# EAGLE design ADCMP607-TDR-head (EAGLE 9.5.0)
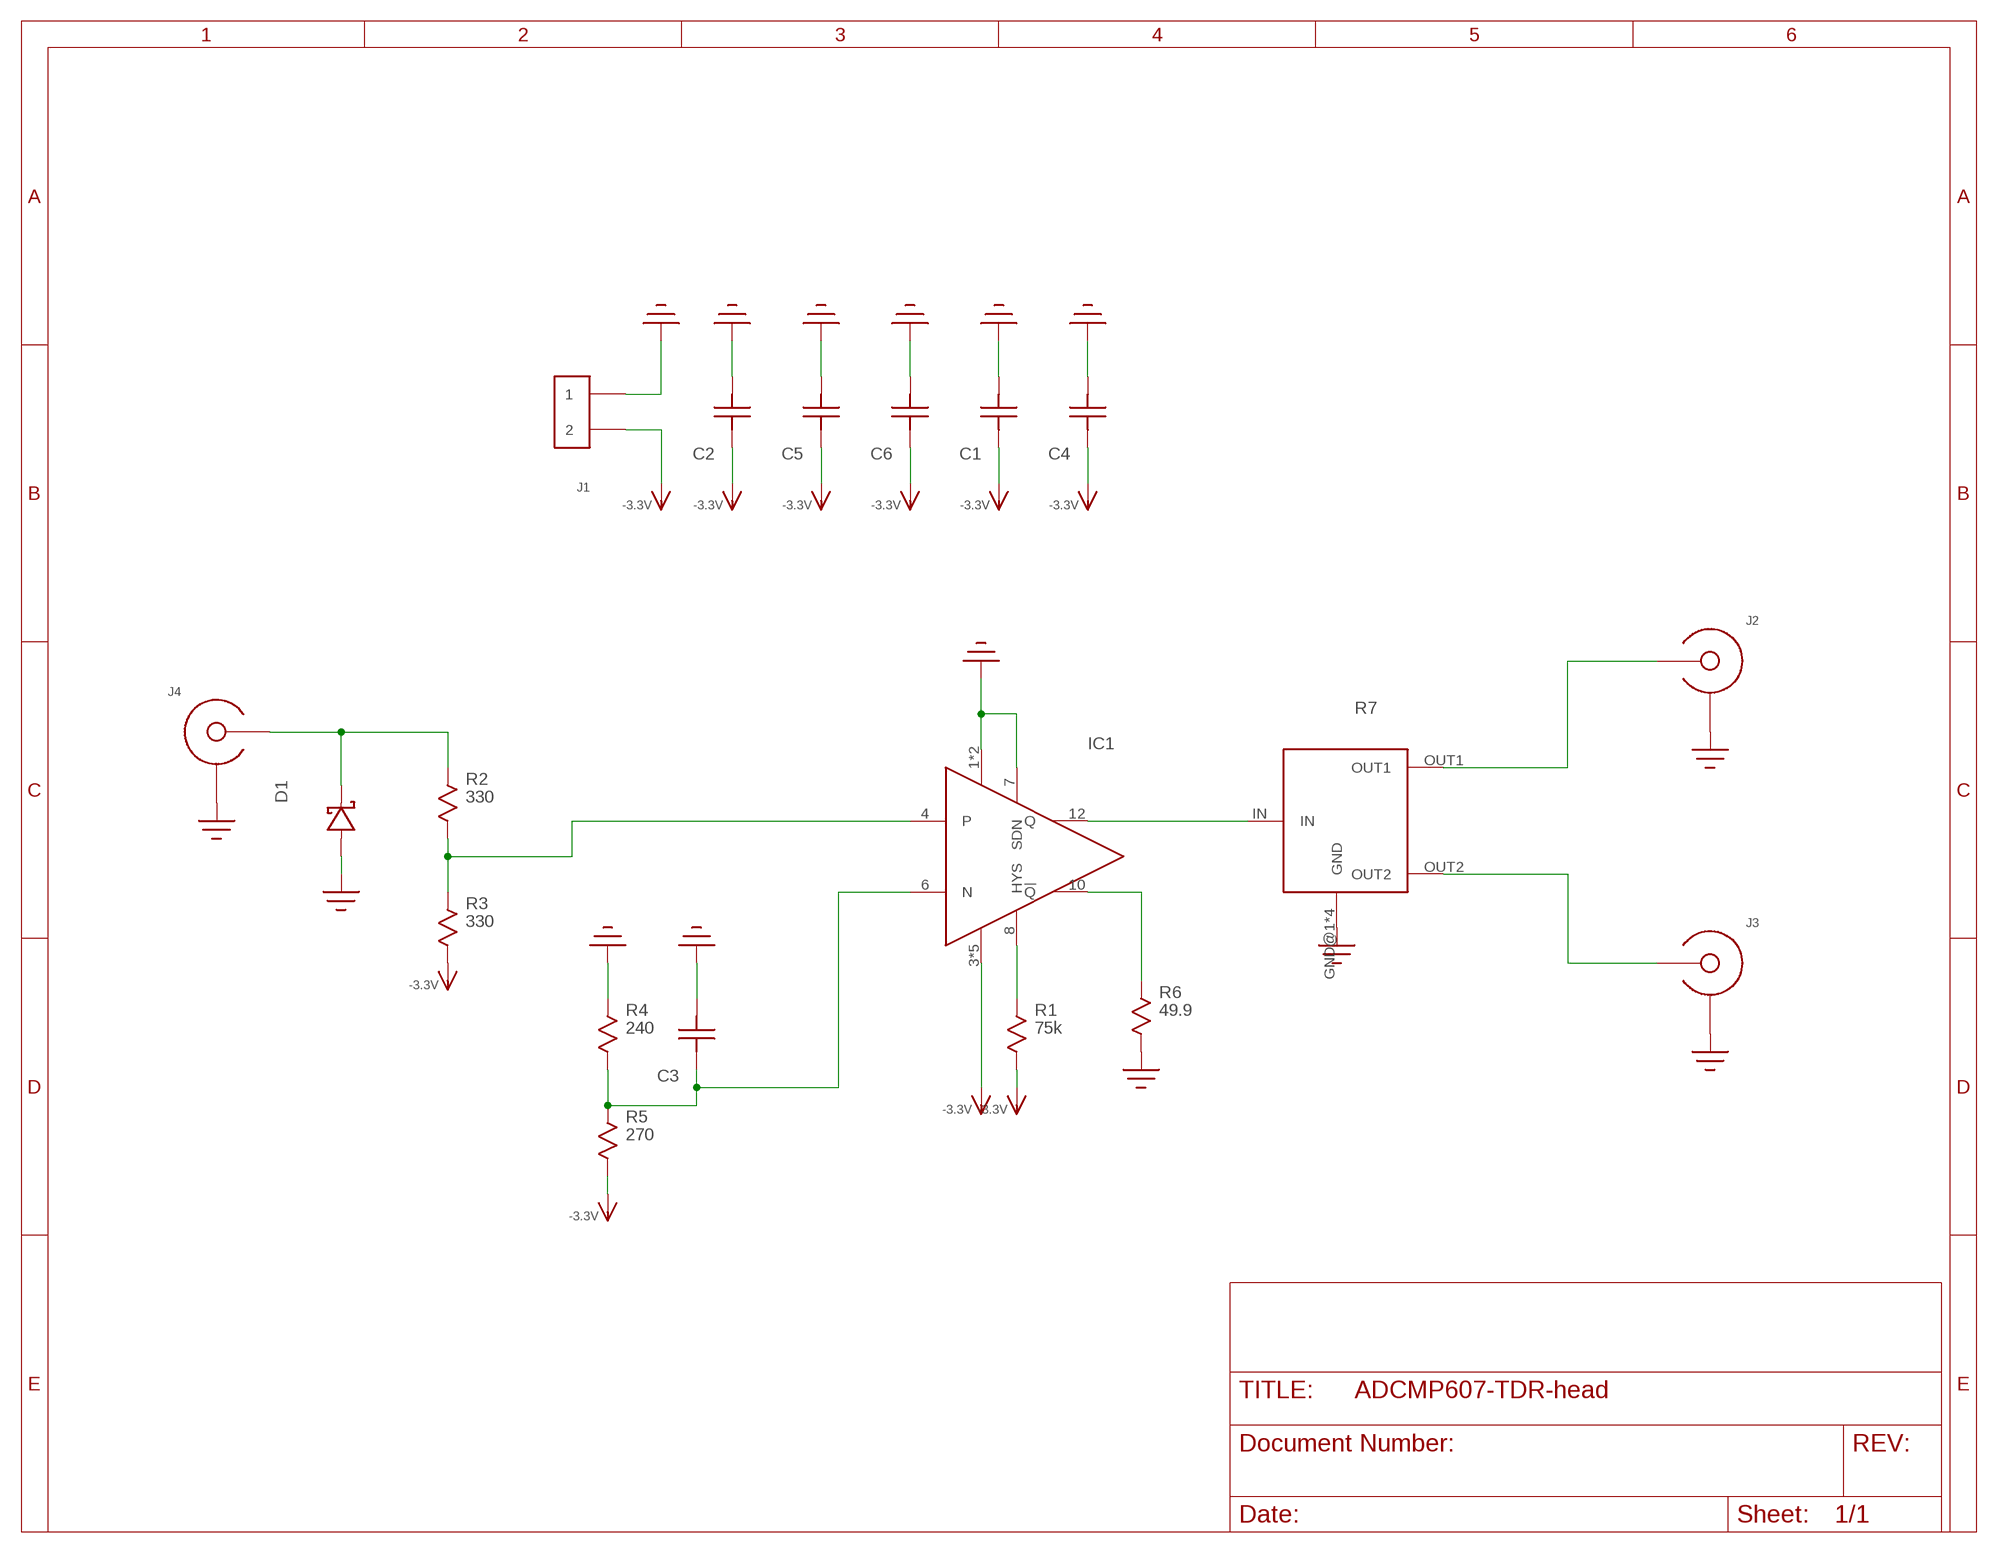
[diagram p0: schematic, sheet 1]

## Parts
C1  C0603  [C0603]
C2  C1206  [1206]
C3  C0603  [C0603]
C4  C0603  [C0603]
C5  C0603  [C0603]
C6  C0603  [C0603]
D1  SCHOTTKYSOT-23  [SOT-23]
IC1  ADCMP607  [QFN12-3X3]
J1  HEADER_2PIN  [HEADER_2PIN]
J2  SMA-EDGE-LAUNCH4020_TAPER  [SMA_EDGE_LAUNCH_2L_4020_TAPER]
J3  SMA-EDGE-LAUNCH4020_TAPER  [SMA_EDGE_LAUNCH_2L_4020_TAPER]
J4  SMA-EDGE-LAUNCH4020_TAPER  [SMA_EDGE_LAUNCH_2L_4020_TAPER]
R1  75k  R0603  [R0603]
R2  330  R0603  [R0603]
R3  330  R0603  [R0603]
R4  240  R0603  [R0603]
R5  270  R0603  [R0603]
R6  49.9  R0402  [0402]
R7  PS2012G-SPLITTER  [PS2012G-SPLITTER]

## Nets
-3.3V: C1.P$2 C2.P$2 C4.P$2 C5.P$2 C6.P$2 IC1.3(VEE) IC1.5(VEE) IC1.9(VEE) IC1.11(VEE) IC1.EP(VEE) J1.2 R1.P$2 R3.P$2 R5.P$2
GND: C1.P$1 C2.P$1 C3.P$1 C4.P$1 C5.P$1 C6.P$1 D1.1(ANODE) IC1.1(VCC) IC1.2(VCC) IC1.7(SDN) J1.1 J2.BOTTOM_GND(SHIELD) J2.GND@1(SHIELD) J2.GND@2(SHIELD) J2.GND@3(SHIELD) J2.GND@4(SHIELD) J2.GND@5(SHIELD) J2.GND@6(SHIELD) J2.GND@7(SHIELD) J2.GND@8(SHIELD) J2.GND@14(SHIELD) J2.GND@15(SHIELD) J2.GND@16(SHIELD) J2.GND@17(SHIELD) J2.GND_PAD1(SHIELD) J2.GND_PAD2(SHIELD) J2.P$1(SHIELD) J2.P$2(SHIELD) J3.BOTTOM_GND(SHIELD) J3.GND@1(SHIELD) J3.GND@2(SHIELD) J3.GND@3(SHIELD) J3.GND@4(SHIELD) J3.GND@5(SHIELD) J3.GND@6(SHIELD) J3.GND@7(SHIELD) J3.GND@8(SHIELD) J3.GND@14(SHIELD) J3.GND@15(SHIELD) J3.GND@16(SHIELD) J3.GND@17(SHIELD) J3.GND_PAD1(SHIELD) J3.GND_PAD2(SHIELD) J3.P$1(SHIELD) J3.P$2(SHIELD) J4.BOTTOM_GND(SHIELD) J4.GND@1(SHIELD) J4.GND@2(SHIELD) J4.GND@3(SHIELD) J4.GND@4(SHIELD) J4.GND@5(SHIELD) J4.GND@6(SHIELD) J4.GND@7(SHIELD) J4.GND@8(SHIELD) J4.GND@14(SHIELD) J4.GND@15(SHIELD) J4.GND@16(SHIELD) J4.GND@17(SHIELD) J4.GND_PAD1(SHIELD) J4.GND_PAD2(SHIELD) J4.P$1(SHIELD) J4.P$2(SHIELD) R4.P$1 R6.2 R7.GND@1(GND) R7.GND@2(GND) R7.GND@3(GND) R7.GND@4(GND)
N$1: C3.P$2 IC1.6(N) R4.P$2 R5.P$1
N$2: IC1.8(HYS) R1.P$1
N$3 [29-6]: IC1.12(Q) R7.IN
N$4 [29-6]: IC1.10(!Q!) R6.1
N$5 [29-6]: D1.3(CATHODE) J4.CENTER@1(CENTER) R2.P$1
N$6 [29-6]: IC1.4(P) R2.P$2 R3.P$1
N$7: J2.CENTER@1(CENTER) R7.OUT1
N$8: J3.CENTER@1(CENTER) R7.OUT2

## Library data of the parts
C1-C6 = yapo:C
D1 = yapo:SCHOTTKY
IC1 = yapo:ADCMP607
J1 = yapo:HEADER_2PIN
J2-J4 = yapo:SMA-EDGE-LAUNCH
R1-R6 = yapo:R
R7 = yapo:PS2012G-SPLITTER

## Net classes
1 29-6: width 0.737 mm, clearance 0.152 mm

## Board
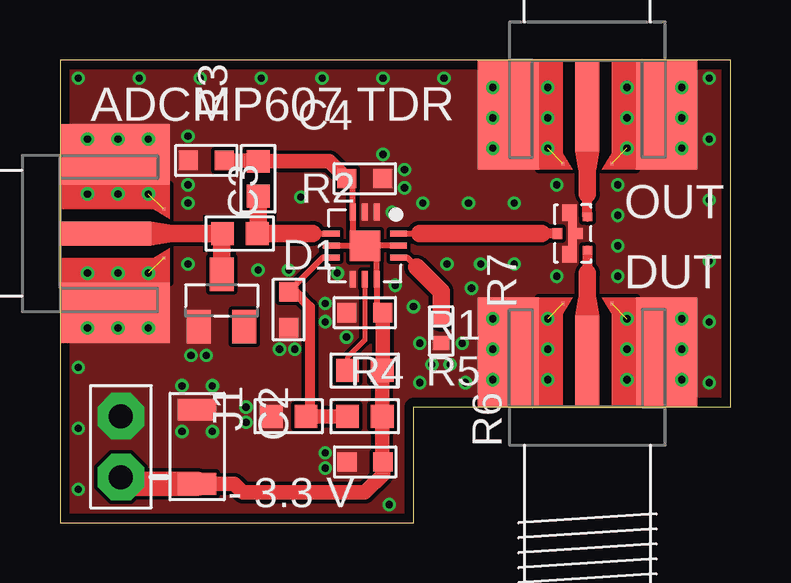
[diagram p1: board, top side]
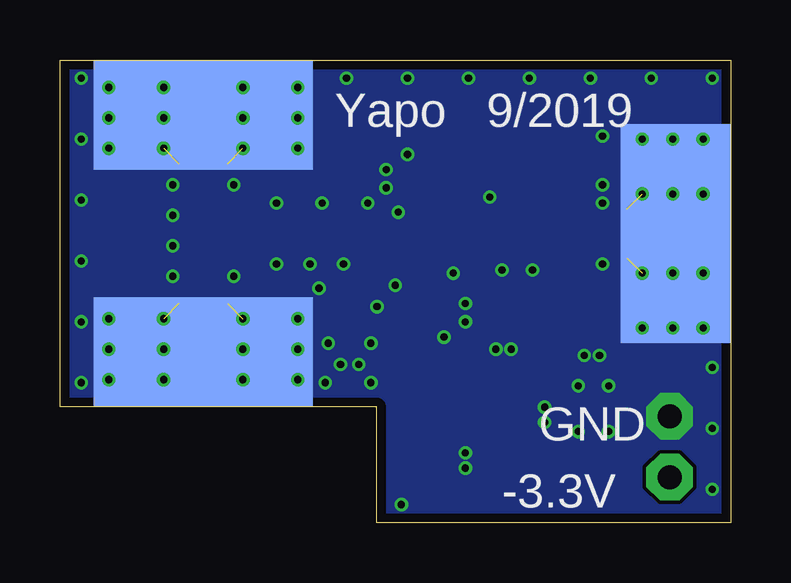
[diagram p2: board, bottom side, seen from below]

Size 27.94 x 19.3 mm. Coordinates in mm from the lower left corner, seen from the top.
Outline: 0,0 14.73,0 14.73,4.83 27.94,4.83 27.94,19.3 0,19.3 0,0
Copper layers (1*16): Top 0.035559375mm / dielectric 1.6mm / Bottom 0.035559375mm
Design rules "oshpark-2layer *": minimum track width 6mil, minimum drill 10mil, track to track 6mil, track to pad 6mil, pad to pad 6mil, via to via 6mil, smd to smd 6mil, copper to edge 15mil, drill to drill 6mil, minimum pad ring 5mil, minimum via ring 5mil, stop-mask expansion 2.5mil, vias tented up to drill 20mil, thermal gap 10mil

### Footprints (pad centres in the part's own frame; a part is rotated, then mirrored left to right if it is on the bottom)
C0603 = smd 0.8 x 0.8: P$1 -0.75,0; P$2 0.75,0
1206 = smd 0.9 x 1.6: P$1 -1.55,0; P$2 1.55,0
SOT-23 = smd 1 x 1.4: 1 -0.95,-1.1; 2 0.95,-1.1; 3 0,1.1
QFN12-3X3 = smd 0.7 x 0.25: 1 -1.4,0.5; 2 -1.4,0; 3 -1.4,-0.5; 7 1.4,-0.5; 8 1.4,0; 9 1.4,0.5 | smd 0.25 x 0.7: 4 -0.5,-1.4; 5 0,-1.4; 6 0.5,-1.4; 10 0.5,1.4; 11 0,1.4; 12 -0.5,1.4 | smd 1.27 x 1.27: EP 0,0
HEADER_2PIN = drill 1 pad 1.93 octagon: 1 -1.27,0; 2 1.27,0
SMA_EDGE_LAUNCH_2L_4020_TAPER = smd 4.572 x 9.144 bottom: BOTTOM_GND 2.286,0 | smd 3.81 x 1.016: CENTER@1 1.905,0 | drill 0.3: GND@1 1.143,3.937; GND@2 3.683,3.937; GND@3 1.143,1.651; GND@4 3.683,1.651; GND@5 1.143,-1.651; GND@6 3.683,-1.651; GND@7 1.143,-3.937; GND@8 3.683,-3.937; GND@14 2.413,3.937; GND@15 2.413,-3.937; GND@16 2.413,-1.651; GND@17 2.413,1.651 | smd 4.572 x 2.54: GND_PAD1 2.286,3.302; GND_PAD2 2.286,-3.302 | smd 0.127 x 0.127: P$1 4.318,1.016; P$2 4.318,-1.016
R0603 = smd 0.95 x 0.95: P$1 -0.725,0; P$2 0.725,0
0402 = smd 0.6 x 0.7: 1 -0.5,0; 2 0.5,0
PS2012G-SPLITTER = smd 0.675 x 0.6: GND@1 -0.863,-0.7; GND@3 0.863,-0.7 | smd 1.05 x 0.35: GND@2 0,-0.825 | smd 0.45 x 0.25: GND@4 0,-1.125 | smd 0.45 x 0.4: IN 0,-0.2 | smd 0.35 x 0.4: OUT1 -0.7,-1.45; OUT2 0.7,-1.45

### Placement (x,y rotation side)
C1  12.71,2.54 0 top
C2  5.71,3.17 270 top
C3  9.53,8.89 90 top
C4  6.1,15.11 0 top
C5  12.7,8.76 0 top
C6  12.7,14.35 180 top
D1  6.73,9.27 0 top
IC1  12.7,11.56 270 top
J1  2.54,3.17 270 top
J2  21.97,4.83 90 top
J3  21.97,19.3 270 top
J4  0,12.06 0 top
R1  12.7,6.35 0 top
R2  7.49,12.06 0 top
R3  8.26,14.35 90 top
R4  9.53,4.45 0 top
R5  12.7,4.45 0 top
R6  15.88,8 270 top
R7  20.52,12.06 90 top

### Tracks (layer width: path | path; a pad name or v marks a point on that pad's centre or on a via)
-3.3V
  Top 0.254: IC1.5 IC1.EP | IC1.11 IC1.EP | IC1.EP 13.2,11.06 IC1.9 13.2,9.01 C5.P$2 | IC1.EP 12.2,12.06 IC1.3 12.2,14.1 C6.P$2
  Top 0.61: C5.P$2 13.45,6.45 13.43,6.36 R1.P$2 R5.P$2 13.43,2.58 C1.P$2 13.46,2.03 12.7,1.27 7.62,1.27 7.26,1.62 C2.P$2 | C4.P$2 8.22,15.11 R3.P$2 11.22,15.08 C6.P$2
  Top 1.016: C2.P$2 2.82,1.62 J1.2
GND  (via drill 0.3)  (6 unrouted)
  other vias: 14.35,13.97 11.94,7.75 14.35,14.73 11.05,9.14 13.46,15.37 11.05,8.38 6.1,6.99 5.46,6.99 7.75,4.83 7.75,4.19 9.14,7.24 9.78,7.24 11.56,10.41 13.84,12.95 11.05,2.92 11.05,2.29 5.08,5.71 6.35,5.71 6.35,3.81 5.08,3.81 5.33,16.13 5.33,14.1 15.49,6.6 16.26,6.6 14.99,7.49 16.76,7.49 13.97,9.91 14.73,9.02 5.33,13.34 10.03,13.59 8.26,10.54 5.84,18.54 3.3,18.54 0.76,18.54 0.76,6.48 0.76,3.94 0.76,1.4 20.7,14.1 23.24,14.1 15.11,13.34 17.02,13.34 18.92,13.34 17.53,10.79 18.92,10.79 16.13,10.79 20.7,10.29 23.24,10.29 23.24,11.56 23.24,12.83 8.38,18.54 10.92,18.54 13.46,18.54 16,18.54 27.05,18.54 27.05,16 27.05,13.46 27.05,10.92 27.05,8.38 27.05,5.84 16.89,5.84 14.99,5.84 13.72,0.76 17.14,9.78 5.33,10.79 9.53,10.54
  pour Top (rank 2, no thermals): 0,0 14.73,0 14.73,4.7 27.94,4.7 27.94,19.3 0,19.3
  pour Bottom (no thermals): 27.94,4.7 27.94,19.3 0,19.3 0,0 14.73,0 14.73,4.7
  cutout Top: 5.97,12.83 5.97,11.3 8.89,11.3 8.89,12.83
  cutout Top: 7.49,14.61 7.49,12.57 9.02,12.57 9.02,14.61
N$1
  Top 0.254: IC1.6 10.94,11.06 C3.P$2
  Top 0.406: C3.P$2 9.78,9.64 10.41,9.01 10.41,4.45 R4.P$2 10.79,4.45
  Top 0.61: 10.79,4.45 R5.P$1
N$2
  Top 0.203: IC1.8 12.7,7.62 11.97,6.89 R1.P$1
N$3
  Top 0.254: 14.99,12.06 IC1.12
  Top 0.406: R7.IN 20.07,12.06
  Top 0.737: 20.07,12.06 14.99,12.06
N$4
  Top 0.254: 14.86,10.67 14.47,11.06 IC1.10
  Top 0.737: R6.1 15.88,9.65 14.86,10.67
N$5
  Top 0.737: 6.73,12.03 R2.P$1 | D1.3 6.73,12.03 | J4.CENTER@1 6.69,12.06 6.73,12.03
N$6
  Top 0.254: 10.54,12.06 IC1.4
  Top 0.737: R3.P$1 8.26,12.1 R2.P$2 10.54,12.06
N$7
  Top 0.406: R7.OUT1 21.97,10.41
  Top 0.737: J2.CENTER@1 21.97,10.41
N$8
  Top 0.406: R7.OUT2 21.97,13.72
  Top 0.737: 21.97,13.72 J3.CENTER@1

### Text on the board
tPlace: ADCMP607 TDR | OUT | DUT | - 3.3 V
bPlace: 9/2019 | Yapo | GND | -3.3V